# EAGLE schematic LabPower test2 (EAGLE 7.1.0)
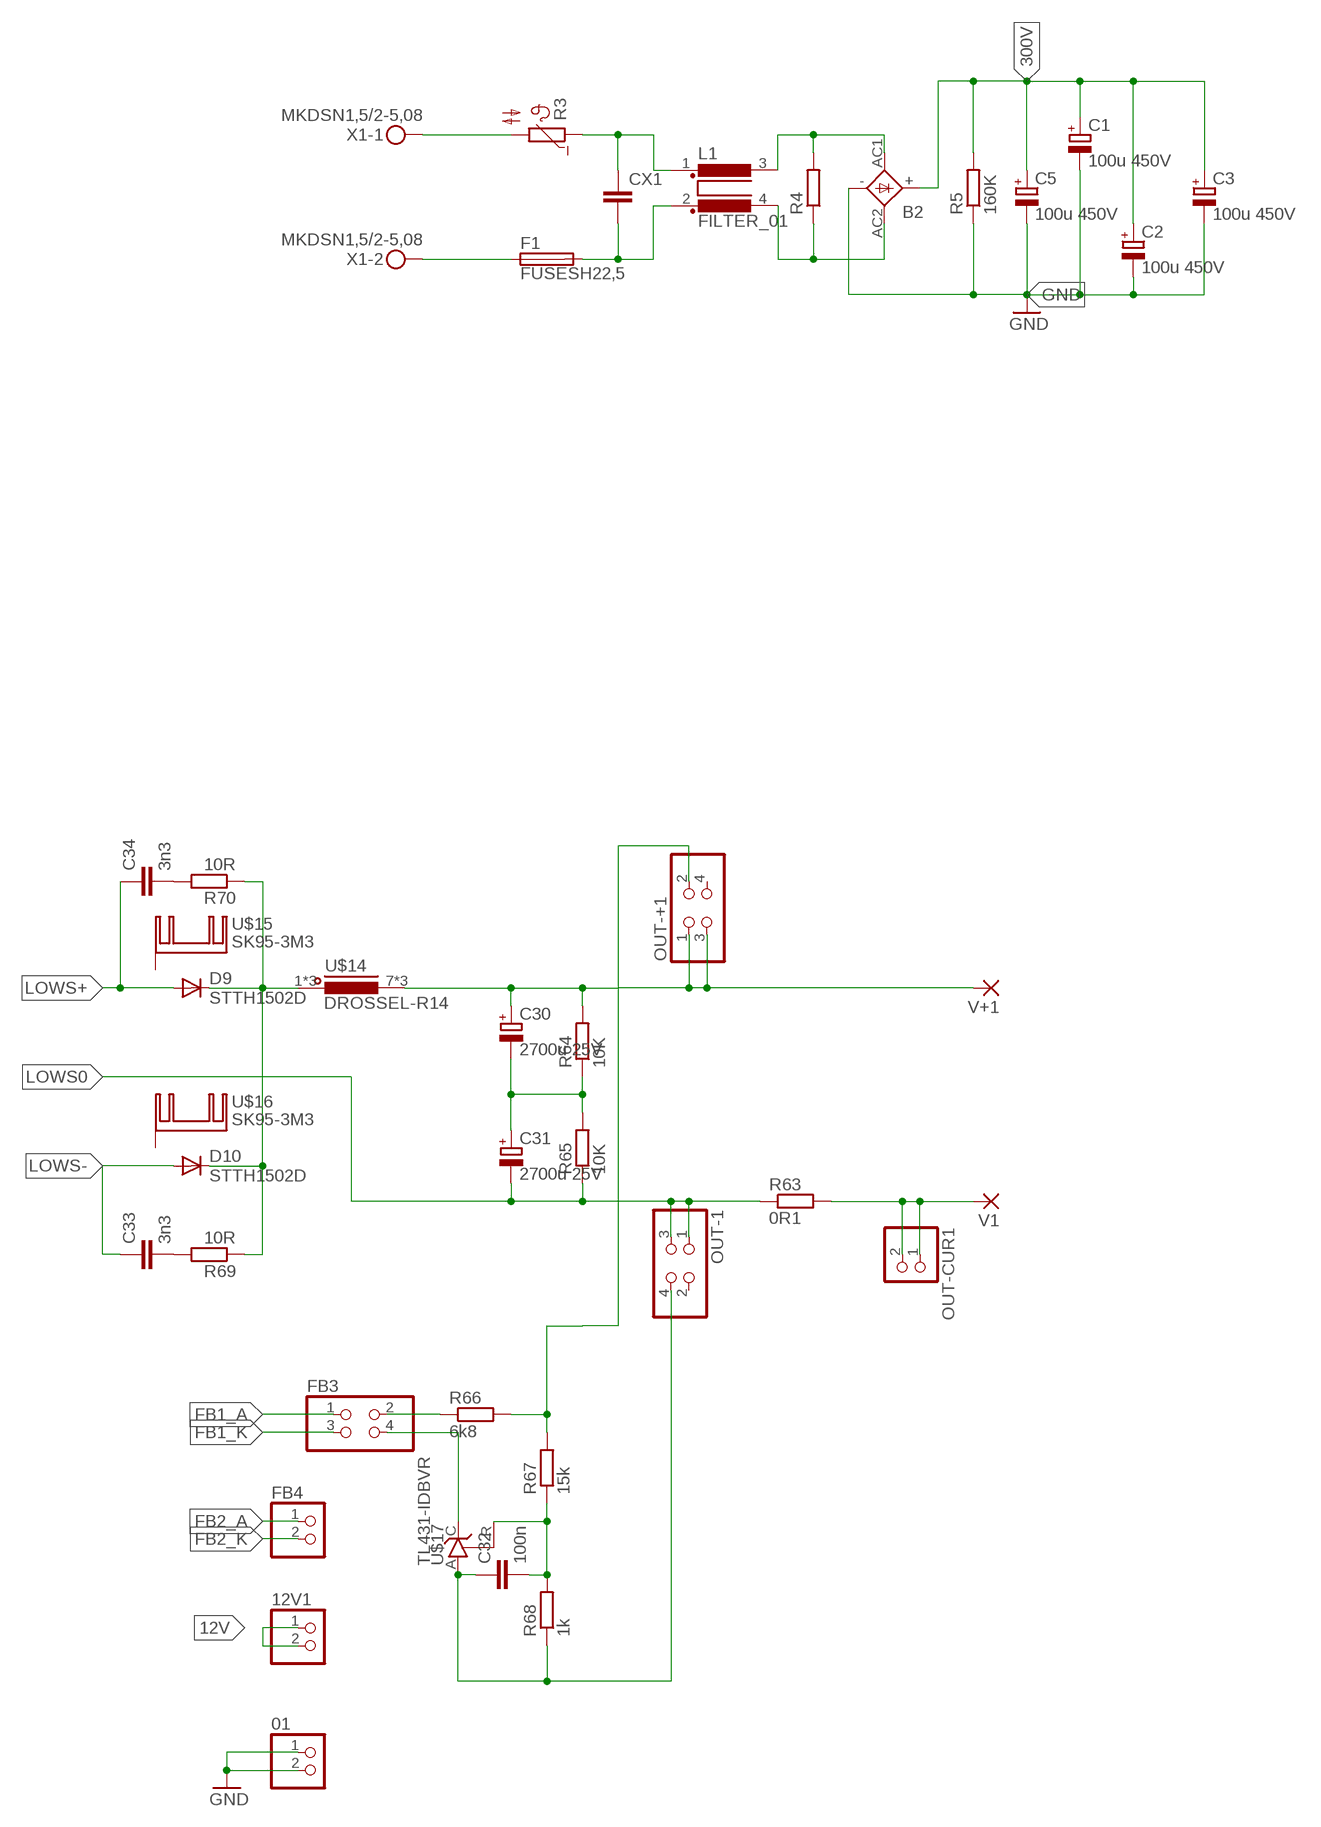
[diagram p0: schematic, sheet 1, part 1 of 2]
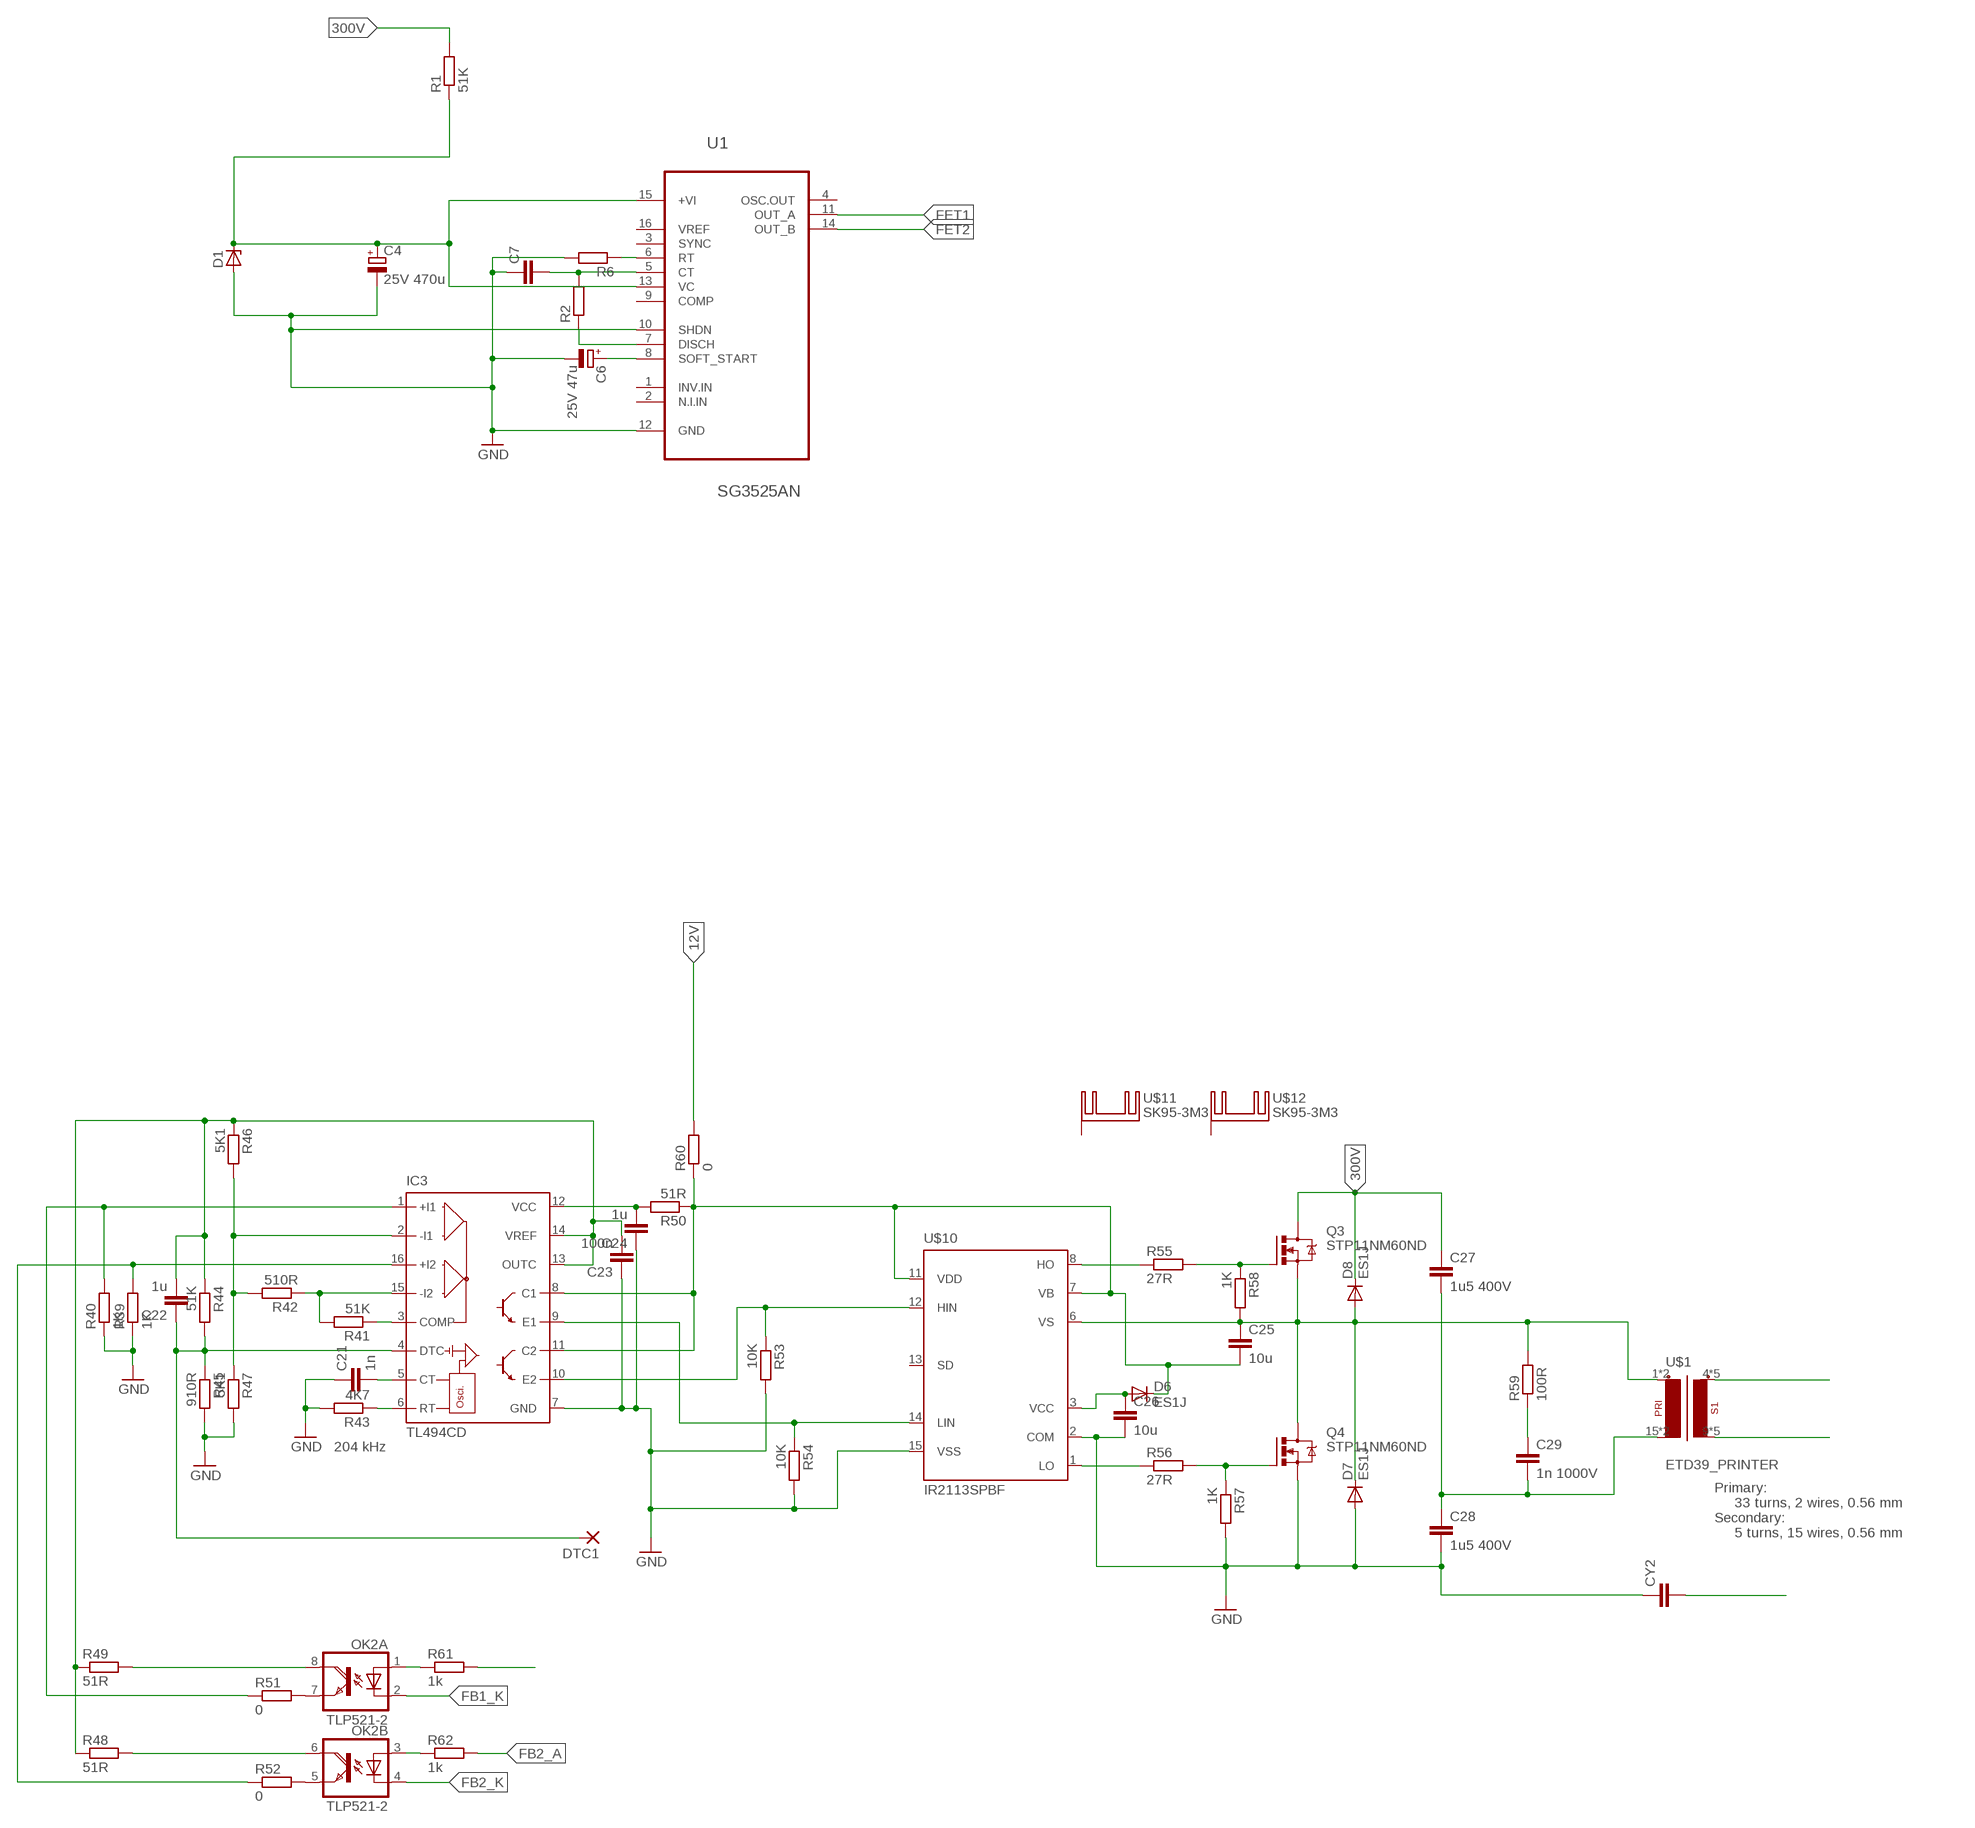
[diagram p1: schematic, sheet 1, part 2 of 2]

## Parts
01  PINHD-1X2  [1X02]
12V1  PINHD-1X2  [1X02]
B2  KBL  [KBL]
C1  100u 450V  CPOL-EUE10-22.5  [EB22,5D]
C2  100u 450V  CPOL-EUE10-22.5  [EB22,5D]
C3  100u 450V  CPOL-EUE10-22.5  [EB22,5D]
C4  25V 470u  CPOL-EUE2.5-7  [E2,5-7]
C5  100u 450V  CPOL-EUE10-22.5  [EB22,5D]
C6  25V 47u  CPOL-EUE2.5-7  [E2,5-7]
C7  C-EUC0805  [C0805]
C21  1n  C-EUC0805  [C0805]
C22  1u  C-EUC0805  [C0805]
C23  100n  C-EUC0805  [C0805]
C24  1u  C-EUC0805  [C0805]
C25  10u  C-EUC0805  [C0805]
C26  10u  C-EUC0805  [C0805]
C27  1u5 400V  C-EU225-087X268  [C225-087X268]
C28  1u5 400V  C-EU225-087X268  [C225-087X268]
C29  1n 1000V  C-EU050-025X075  [C050-025X075]
C30  2700u 25V  CPOL-EUE7.5-18  [E7,5-18]
C31  2700u 25V  CPOL-EUE7.5-18  [E7,5-18]
C32  100n  C-EUC0805  [C0805]
C33  3n3  C-EUC0805  [C0805]
C34  3n3  C-EUC0805  [C0805]
CX1  CXXC15B8  [XC15B8]
CY2  CYYC10B4  [YC10B4]
D1  ZENER-DIODEDO41Z10  [DO41Z10]
D6  ES1J  DIODE-DO214AC  [DO214AC]
D7  ES1J  DIODE-DO214AC  [DO214AC]
D8  ES1J  DIODE-DO214AC  [DO214AC]
D9  STTH1502D  DIODE-DO220S  [DO220S]
D10  STTH1502D  DIODE-DO220S  [DO220S]
DTC1  SMD5  [SMD2,54-5,08]
F1  FUSESH22,5  [SH22,5]
FB3  PINHD-2X2  [2X02]
FB4  PINHD-1X2  [1X02]
IC3  TL494CD  [SO16]
L1  FILTER_01  [82721K]
OK2  TLP521-2  TIL198  [DIL08]
OUT-1  PINHD-2X2  [2X02]
OUT-+1  PINHD-2X2  [2X02]
OUT-CUR1  PINHD-1X2  [1X02]
Q3  STP11NM60ND  IRF740  [TO220BV]
Q4  STP11NM60ND  IRF740  [TO220BV]
R1  51K  R_SQP-5  [SQP-5]
R2  R-EU_R0805  [R0805]
R3  B57164  [B57164]
R4  R-EU_0309/10  [0309/10]
R5  160K  R-EU_0207/12  [0207/12]
R6  R-EU_R0805  [R0805]
R39  1K  R-EU_R0805  [R0805]
R40  1K  R-EU_R0805  [R0805]
R41  51K  R-EU_R0805  [R0805]
R42  510R  R-EU_R0805  [R0805]
R43  4K7  R-EU_R0805  [R0805]
R44  51K  R-EU_R0805  [R0805]
R45  910R  R-EU_R0805  [R0805]
R46  5K1  R-EU_R0805  [R0805]
R47  5K1  R-EU_R0805  [R0805]
R48  51R  R-EU_R0805  [R0805]
R49  51R  R-EU_R0805  [R0805]
R50  51R  R-EU_R0805  [R0805]
R51  0  R-EU_R1206  [R1206]
R52  0  R-EU_R1206  [R1206]
R53  10K  R-EU_R0805  [R0805]
R54  10K  R-EU_R0805  [R0805]
R55  27R  R-EU_R1206  [R1206]
R56  27R  R-EU_R1206  [R1206]
R57  1K  R-EU_R0805  [R0805]
R58  1K  R-EU_R0805  [R0805]
R59  100R  R-EU_0617/17  [0617/17]
R60  0  R-EU_R1206  [R1206]
R61  1k  R-EU_R0805  [R0805]
R62  1k  R-EU_R0805  [R0805]
R63  0R1  R_SQP-10  [SQP-10]
R64  10K  R-EU_0207/10  [0207/10]
R65  10K  R-EU_0207/10  [0207/10]
R66  6k8  R-EU_R0805  [R0805]
R67  15k  R-EU_R0805  [R0805]
R68  1k  R-EU_R0805  [R0805]
R69  10R  R-EU_R0805  [R0805]
R70  10R  R-EU_R0805  [R0805]
U1  SG3525AN  [DIP254P762X510-16]
U$1  ETD39_PRINTER  [ETD39_16PIN]
U$10  IR2113SPBF  [SO16W]
U$11  SK95-3M3  [SK95-3M3]
U$12  SK95-3M3  [SK95-3M3]
U$14  DROSSEL-R14  [RM14]
U$15  SK95-3M3  [SK95-3M3]
U$16  SK95-3M3  [SK95-3M3]
U$17  TL431-IDBVR  [SOT23-5]
V1  3,81/1,4  [3,81/1,4]
V+1  3,81/1,4  [3,81/1,4]
X1  MKDSN1,5/2-5,08  [MKDSN1,5/2-5,08]

## Nets
12V: 12V1.1 12V1.2 R60.2
300V: B2.+ C1.+ C2.+ C3.+ C5.+ C27.1 D8.C Q3.D R1.2 R5.2
AC1: B2.AC2(AC1) L1.4 R4.1
AC2: B2.AC1(AC2) L1.3 R4.2
FB1_A: FB3.1
FB1_A1: R61.2
FB1_K: FB3.3 OK2.2(A:C)
FB2_A: FB4.1 R62.2
FB2_K: FB4.2 OK2.4(B:C)
FET1: U1.11(OUT_A)
FET2: U1.14(OUT_B)
GND: 01.1 01.2 B2.- C1.- C2.- C3.- C4.- C5.- C6.- C7.1 C21.1 C23.1 C24.1 C26.2 C28.2 CY2.1 D1.A D7.A IC3.7(GND) Q4.S R5.1 R6.2 R39.1 R40.1 R43.2 R45.2 R47.2 R53.2 R54.2 R57.2 U1.10(SHDN) U1.12(GND) U$10.2(COM) U$10.15(VSS)
LOWS0: C31.- CY2.2 OUT-1.1 OUT-1.3 R63.P$1 R65.1
LOWS+: C34.1 D9.A
LOWS-: C33.1 D10.A
N$1: U$1.4(S1-1) U$1.5(S1-1) U$1.6(S1-1) U$1.7(S1-1) U$1.8(S1-1)
N$2: U$1.9(S1-2) U$1.10(S1-2) U$1.11(S1-2) U$1.12(S1-2) U$1.13(S1-2)
N$3: C6.+ U1.8(SOFT_START)
N$4: C4.+ D1.C R1.1 U1.13(VC) U1.15(+VI)
N$5: C7.2 R2.2 U1.5(CT)
N$6: F1.1 X1.2
N$7: R3.2 X1.1
N$8: R2.1 U1.7(DISCH)
N$9: CX1.1 L1.1 R3.1
N$10: CX1.2 F1.2 L1.2
N$12: R6.1 U1.6(RT)
N$27: IC3.1(+I1) R40.2 R51.1
N$44: IC3.16(+I2) R39.2 R52.1
N$45: IC3.3(COMP) R41.1
N$48: IC3.15(-I2) R41.2 R42.1
N$49: IC3.6(RT) R43.1
N$50: C21.2 IC3.5(CT)
N$51: C22.1 DTC1.1(P) IC3.4(DTC) R44.2 R45.1
N$52: C22.2 C23.2 IC3.13(OUTC) IC3.14(VREF) R44.1 R46.1 R48.1 R49.1
N$53: IC3.2(-I1) R42.2 R46.2 R47.1
N$54: OK2.6(B:COL) R48.2
N$55: OK2.8(A:COL) R49.2
N$56: C24.2 IC3.12(VCC) R50.2
N$57: IC3.10(E2) R53.1 U$10.12(HIN)
N$58: IC3.9(E1) R54.1 U$10.14(LIN)
N$59: R55.1 U$10.8(HO)
N$60: R56.1 U$10.1(LO)
N$61: Q4.G R56.2 R57.1
N$62: Q3.G R55.2 R58.1
N$63: C27.2 C28.1 C29.2 U$1.15(P1-2) U$1.16(P1-2)
N$64: C29.1 R59.1
N$65: OK2.7(A:EMI) R51.2
N$66: OK2.5(B:EMI) R52.2
N$67: OK2.1(A:A) R61.1
N$68: OK2.3(B:A) R62.1
N$69: D9.C D10.C R69.1 R70.1 U$14.1 U$14.2 U$14.3
N$70: C30.+ OUT-+1.1 OUT-+1.3 R64.2 U$14.7 U$14.8 U$14.9 V+1.1(P)
N$71: OUT-CUR1.1 OUT-CUR1.2 R63.P$2 V1.1(P)
N$72: C30.- C31.+ R64.1 R65.2
N$73: FB3.2 R66.1
N$74: FB3.4 U$17.C
N$75: C32.1 OUT-1.4 R68.1 U$17.A
N$76: C32.2 R67.1 R68.2 U$17.R
N$77: OUT-+1.2 R66.2 R67.2
N$78: C33.2 R69.2
N$79: C34.2 R70.2
VB: C25.2 D6.C IC3.8(C1) IC3.11(C2) R50.1 R60.1 U$10.7(VB) U$10.11(VDD)
VCC: C26.1 D6.A U$10.3(VCC)
VS: C25.1 D7.C D8.A Q3.S Q4.D R58.2 R59.2 U$1.1(P1-1) U$1.2(P1-1) U$10.6(VS)
Unconnected: OUT-1.2 OUT-+1.4 U1.1(INV.IN) U1.2(N.I.IN) U1.3(SYNC) U1.4(OSC.OUT) U1.9(COMP) U1.16(VREF) U$10.13(SD) U$11.P$1(K) U$12.P$1(K) U$15.P$1(K) U$16.P$1(K)

## Notes on the sheet
- 204 kHz
- Primary:
       33 turns, 2 wires, 0.56 mm
  Secondary:
       5 turns, 15 wires, 0.56 mm

## Library data of the parts
01 12V1 FB4 OUT-CUR1 = pinhead:PINHD-1X2: PIN HEADER
B2 = rectifier:KBL: DIOTEC RECTIFIER
C1-C6 C30 C31 = rcl:CPOL-EU: POLARIZED CAPACITOR, European symbol
C7 C21-C29 C32-C34 = rcl:C-EU: CAPACITOR, European symbol
CX1 = rcl:CX: X CAPACITOR for power line
CY2 = rcl:CY: Y CAPACITOR for power line
D1 = diode:ZENER-DIODE: Z-Diode
D6-D10 = diode:DIODE-: DIODE
DTC1 = wirepad:SMD5: SMD PAD
F1 = fuse:FUSE: Fuse; OC_FARNELL: unknown; OC_NEWARK: unknown
FB3 OUT-1 OUT-+1 = pinhead:PINHD-2X2: PIN HEADER
IC3 = linear:TL494*: SWITCHMODE Pulse Width Modulation Control Circuit NCV494B http://onsemi.com tl494-d.pdf
L1 = _Transformers:FILTER_01
OK2 = optocoupler:TIL198: TEXAS INSTRUMENTS OPTO COUPLER; OC_FARNELL: unknown; OC_NEWARK: unknown
Q3 Q4 = transistor-power:IRF740: N-CHANNEL MOS FET
R1 = Namenlos:R_SQP-5
R2 R4-R6 R39-R62 R64-R70 = rcl:R-EU_: RESISTOR, European symbol
R3 = ptc-ntc:B57164: SIEMENS NTC; MPN: B57164K474K52; OC_FARNELL: 9753451; OC_NEWARK: 29M3118
R63 = Namenlos:R_SQP-10
U1 = ST Microelctronics_By_element14_Batch_1:SG3525AN: REGULATING PULSE WIDTH MODULATORS; MPN: SG3525AN; OC_FARNELL: 1564368; OC_NEWARK: 89K1506; PACKAGE: PDIP-16; SUPPLIER: STMICROELECTRONICS
U$1 = _Transformers:ETD39_PRINTER
U$10 = Namenlos:IR2113SPBF
U$11 U$12 U$15 U$16 = heatsink:SK95-3M3
U$14 = _Transformers:DROSSEL-R14
U$17 = TL431:TL431-IDBVR
V1 V+1 = wirepad:3,81/1,4: THROUGH-HOLE PAD
X1 = con-phoenix-508:MKDSN1,5/2-5,08: MKDSN 1,5/ 2-5,08 Printklemme Nennstrom: 13,5 A Nennspannung: 250 V Rastermaß: 5,08 mm Polzahl: 2 Anschlussart: Schraubanschluss Montage: Löten Anschlussrichtung Leiter/Platine: 0 ° Artikelnummer: 1729128 Source: http://eshop.phoenixcontact.com .. 1729128.pdf

## Net classes
0 default: clearance 0.205 mm